# EAGLE schematic steve (EAGLE 8.4.3)
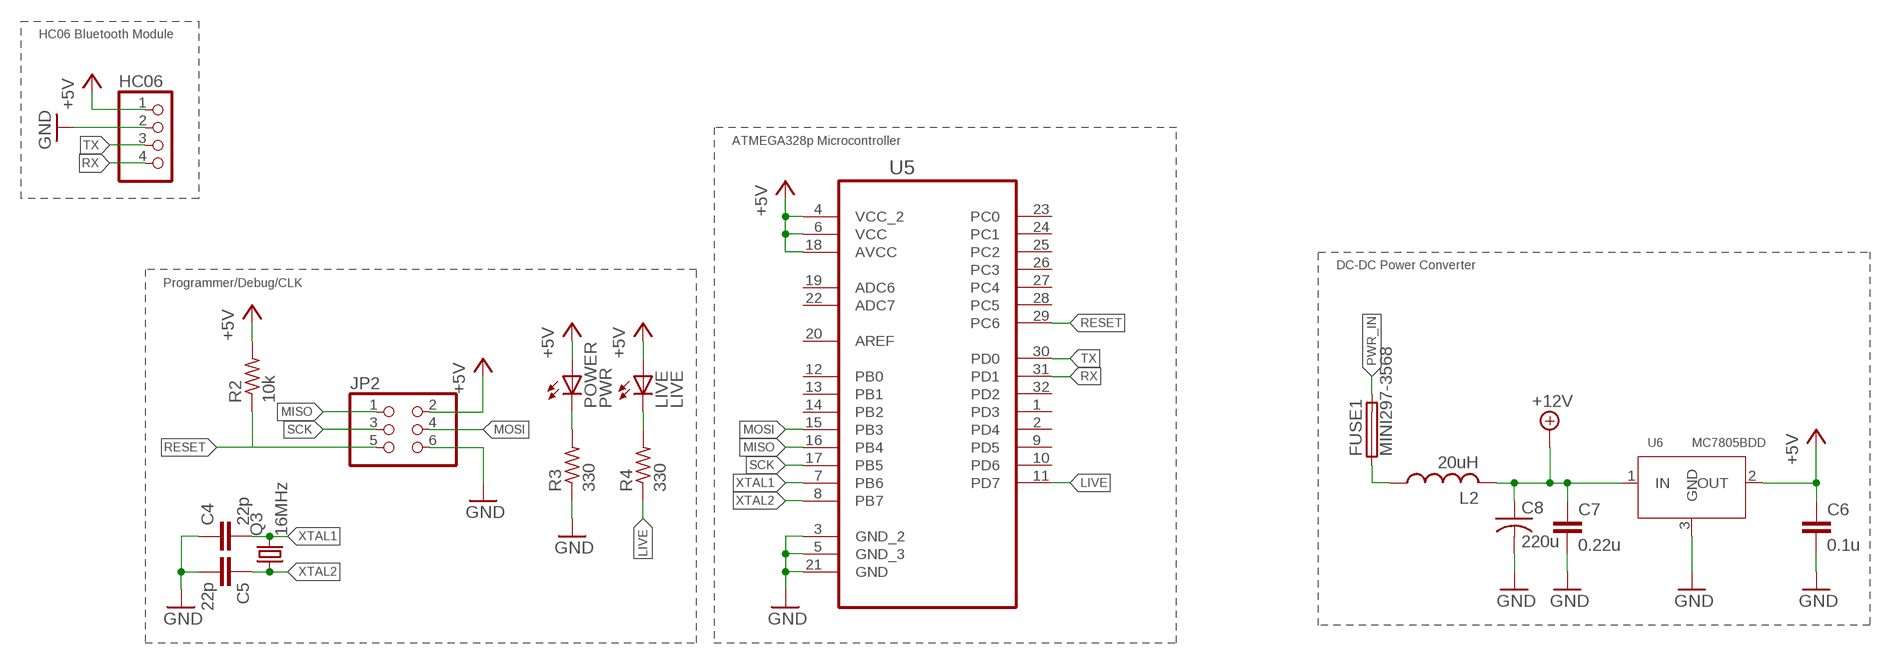
[diagram p0: schematic, sheet 1]

## Parts
C4  22p  C-EUC0805K  [C0805K]
C5  22p  C-EUC0805K  [C0805K]
C6  0.1u  C-EUC0805K  [C0805K]
C7  0.22u  C-EUC0805K  [C0805K]
C8  220u  C1206  [C1206]
FUSE1  MINI297-3568  [3568]
HC06  PINHD-1X4  [1X04]
JP2  PINHD-2X3  [2X03]
L2  20uH  MSS7348  [MSS7348]
LIVE  LIVE  LEDSML0805  [SML0805]
POWER  PWR  LEDSML0805  [SML0805]
Q3  16MHz  CRYSTALCTS406  [CTS406]
R2  10k  R-US_R0805  [R0805]
R3  330  R-US_R0805  [R0805]
R4  330  R-US_R0805  [R0805]
U5  ATMEGA328P-AU  [QFP80P900X900X120-32N]
U6  MC7805BDD  [DPAK]

## Nets
+5V: C6.1 HC06.1 JP2.2 LIVE.A POWER.A R2.2 U5.4(VCC_2) U5.6(VCC) U5.18(AVCC) U6.2(OUT)
+12V: C7.1 C8.1 L2.P$2 U6.1(IN)
GND: C4.1 C5.2 C6.2 C7.2 C8.2 HC06.2 JP2.6 R3.1 U5.3(GND_2) U5.5(GND_3) U5.21(GND) U6.3(GND)
LIVE: R4.1 U5.11(PD7)
MISO: JP2.1 U5.16(PB4)
MOSI: JP2.4 U5.15(PB3)
N$16: POWER.C R3.2
N$17: LIVE.C R4.2
PWR_IN: FUSE1.P$1 FUSE1.P$2 FUSE1.P$3 FUSE1.P$4 L2.P$1
RESET: JP2.5 R2.1 U5.29(PC6)
RX: HC06.4 U5.31(PD1)
SCK: JP2.3 U5.17(PB5)
TX: HC06.3 U5.30(PD0)
XTAL1: C4.2 Q3.3 U5.7(PB6)
XTAL2: C5.1 Q3.1 U5.8(PB7)
Unconnected: U5.1(PD3) U5.2(PD4) U5.9(PD5) U5.10(PD6) U5.12(PB0) U5.13(PB1) U5.14(PB2) U5.19(ADC6) U5.20(AREF) U5.22(ADC7) U5.23(PC0) U5.24(PC1) U5.25(PC2) U5.26(PC3) U5.27(PC4) U5.28(PC5) U5.32(PD2)

## Notes on the sheet
- HC06 Bluetooth Module
- ATMEGA328p Microcontroller
- DC-DC Power Converter
- Programmer/Debug/CLK

## Library data of the parts
C4 C5 = resistor:C-EU: CAPACITOR, European symbol
C6 C7 = rcl:C-EU: CAPACITOR, European symbol
C8 = Capacitors:C1206
FUSE1 = Fuse:MINI297-3568
HC06 = Headers_IFE:PINHD-1X4: PIN HEADER
JP2 = pinhead:PINHD-2X3: PIN HEADER
L2 = Inductors:MSS7348
LIVE POWER = led:LED: LED OSRAM: - CHIPLED LG R971, LG N971, LY N971, LG Q971, LY Q971, LO R971, LY R971 LH N974, LH R974 LS Q976, LO Q976, LY Q976 LO Q996 - Hyper CHIPLED LW Q18S LB Q993, LB Q99A, LB R99A - SideLED LS A670, LO A670, LY A670, LG A670, LP A670 LB A673, LV A673, LT A673, LW A673 LH A674 LY A675 LS A676, LA A676, LO A676, LY A676, LW A676 LS A679, LY A679, LG A679 - Hyper Micro SIDELED® LS Y876, LA Y876, LO Y876, LY Y876 LT Y87S - SmartLED LW L88C, LW L88S LB L89C, LB L89S, LG L890 LS L89K, LO L89K, LY L89K LS L896, LA L896, LO L896, LY L896 - TOPLED LS T670, LO T670, LY T670, LG T670, LP T670 LSG T670, LSP T670, LSY T670, LOP T670, LYG T670 LG T671, LOG T671, LSG T671 LB T673, LV T673, LT T673, LW T673 LH T674 LS T676, LA T676, LO T676, LY T676, LB T676, LH T676, LSB T676, LW T676 LB T67C, LV T67C, LT T67C, LS T67K, LO T67K, LY T67K, LW E67C LS E67B, LA E67B, LO E67B, LY E67B, LB E67C, LV E67C, LT E67C LW T67C LS T679, LY T679, LG T679 LS T770, LO T770, LY T770, LG T770, LP T770 LB T773, LV T773, LT T773, LW T773 LH T774 LS E675, LA E675, LY E675, LS T675 LS T776, LA T776, LO T776, LY T776, LB T776 LHGB T686 LT T68C, LB T68C - Hyper Mini TOPLED® LB M676 - Mini TOPLED Santana® LG M470 LS M47K, LO M47K, LY M47K Source: http://www.osram.convergy.de LUXEON: - LUMILED® LXK2-PW12-R00, LXK2-PW12-S00, LXK2-PW14-U00, LXK2-PW14-V00 LXK2-PM12-R00, LXK2-PM12-S00, LXK2-PM14-U00 LXK2-PE12-Q00, LXK2-PE12-R00, LXK2-PE12-S00, LXK2-PE14-T00, LXK2-PE14-U00 LXK2-PB12-K00, LXK2-PB12-L00, LXK2-PB12-M00, LXK2-PB14-N00, LXK2-PB14-P00, LXK2-PB14-Q00 LXK2-PR12-L00, LXK2-PR12-M00, LXK2-PR14-Q00, LXK2-PR14-R00 LXK2-PD12-Q00, LXK2-PD12-R00, LXK2-PD12-S00 LXK2-PH12-R00, LXK2-PH12-S00 LXK2-PL12-P00, LXK2-PL12-Q00, LXK2-PL12-R00 Source: www.luxeon.com KINGBRIGHT: KA-3528ASYC Source: www.kingbright.com
Q3 = adafruit:CRYSTAL: CRYSTAL; OC_FARNELL: unknown; OC_NEWARK: unknown
R2-R4 = rcl:R-US_: RESISTOR, American symbol
U5 = Atmel_By_element14_Batch_1-00:ATMEGA328P-AU: 8-bit Microcontroller with In-System Programmable Flash; MPN: ATMEGA328P-AU; OC_FARNELL: 1715486; OC_NEWARK: 14R4631; PACKAGE: TQFP-32; SUPPLIER: Atmel
U6 = IC's:MC7805BD